# Altium project pay-optical.PrjPCB (part 1 of 2)
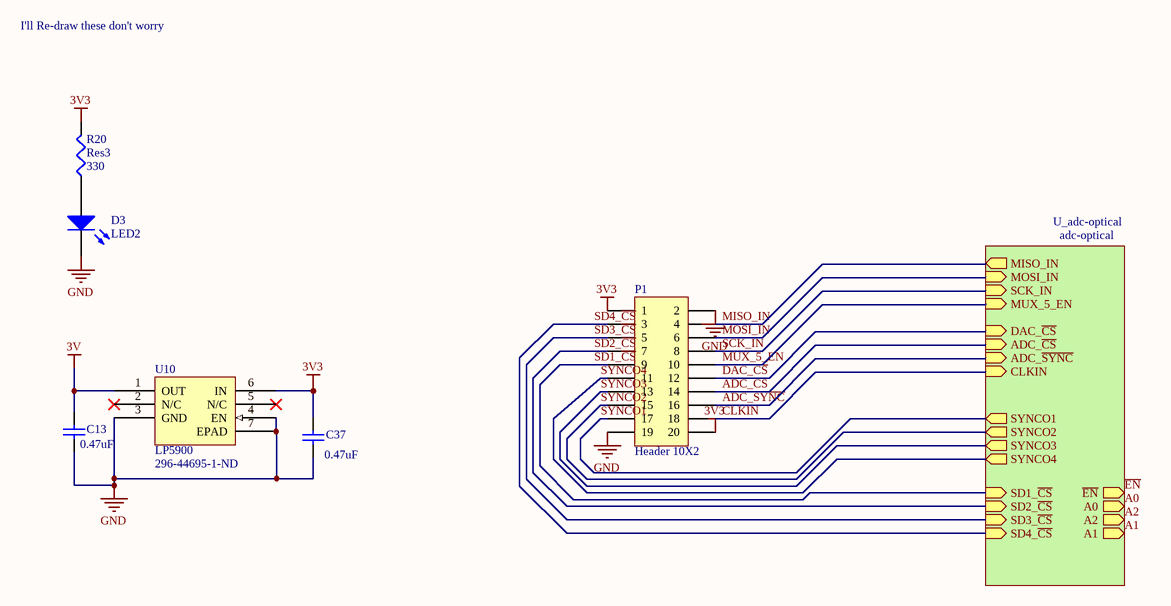
[diagram p0: pay-optical.SchDoc]
8 sheets, 629 parts. Net scope: hierarchical (ports join the sheet entries above them; power ports are global).
Board file: pay-optical.PcbDoc
Sheets:
  pay-optical.SchDoc
    U_adc-optical = adc-optical.SchDoc
      SD1 = filtering-optical.SchDoc
        AC1 = amplifier-chain.SchDoc
        AC2 = amplifier-chain.SchDoc
        AC3 = amplifier-chain.SchDoc
        AC4 = amplifier-chain.SchDoc
        AC5 = amplifier-chain.SchDoc
        AC6 = amplifier-chain.SchDoc
        AC7 = amplifier-chain.SchDoc
        AC8 = amplifier-chain.SchDoc
        MUX_LED = mux-optical.SchDoc
        MUX_S = mux-optical.SchDoc
      SD2 = filtering-optical.SchDoc
        AC1 = amplifier-chain.SchDoc
        AC2 = amplifier-chain.SchDoc
        AC3 = amplifier-chain.SchDoc
        AC4 = amplifier-chain.SchDoc
        AC5 = amplifier-chain.SchDoc
        AC6 = amplifier-chain.SchDoc
        AC7 = amplifier-chain.SchDoc
        AC8 = amplifier-chain.SchDoc
        MUX_LED = mux-optical.SchDoc
        MUX_S = mux-optical.SchDoc
      SD3 = filtering-optical.SchDoc
        AC1 = amplifier-chain.SchDoc
        AC2 = amplifier-chain.SchDoc
        AC3 = amplifier-chain.SchDoc
        AC4 = amplifier-chain.SchDoc
        AC5 = amplifier-chain.SchDoc
        AC6 = amplifier-chain.SchDoc
        AC7 = amplifier-chain.SchDoc
        AC8 = amplifier-chain.SchDoc
        MUX_LED = mux-optical.SchDoc
        MUX_S = mux-optical.SchDoc
      SD4 = filtering-optical.SchDoc
        AC1 = amplifier-chain.SchDoc
        AC2 = amplifier-chain.SchDoc
        AC3 = amplifier-chain.SchDoc
        AC4 = amplifier-chain.SchDoc
        AC5 = amplifier-chain.SchDoc
        AC6 = amplifier-chain.SchDoc
        AC7 = amplifier-chain.SchDoc
        AC8 = amplifier-chain.SchDoc
        MUX_LED = mux-optical.SchDoc
        MUX_S = mux-optical.SchDoc
      SD5_Special = filtering-optical-special.SchDoc
        AC1 = amplifier-chain.SchDoc
        AC2 = amplifier-chain.SchDoc
        MUX_LED = mux-optical.SchDoc
        MUX_S = mux-optical.SchDoc
        U_amplifier-special = amplifier-special.SchDoc
      U_dac-layout = dac-layout.SchDoc

## Sheet pay-optical.SchDoc: PAY-OPTICAL
size A4; DrawnBy: Dylan Vogel; Organization: UTAT SS; DocumentNumber: 1; Revision: 1; SheetNumber: 1; SheetTotal: 7

### Parts
C13  0.47uF  [1608[0603]]
C37  0.47uF  [1608[0603]]
D3  LED2  [0603-LED]
P1  Header 10X2  [CON20_2X10_DUA00]
R20  Res3  value 330  [0402]
U10  LP5900  Supplier Part Number 1: 296-44695-1-ND  [DFN220X250X80-7N]

### Sub-sheets
U_adc-optical = adc-optical: ADC_~{CS} (in), DAC_~{CS} (in), SD1_~{CS} (in), SD2_~{CS} (in), SD3_~{CS} (in), SD4_~{CS} (in), SYNCO1 (out), SYNCO2 (out), SYNCO3 (out), SYNCO4 (out), MISO_IN (out), MOSI_IN (in), SCK_IN (in), ~{EN} (out), A0 (out), A2 (out), A1 (out), ADC_~{SYNC} (in), MUX_5_EN (in), CLKIN (in)

### Nets
3V: C13.2 U10.1(OUT)
3V3: C37.2 P1.1 P1.20 R20.2 U10.6(IN)
GND: C13.1 C37.1 D3.2(K) P1.2 P1.19 U10.3(GND) U10.4(EN) U10.7(EPAD)
ADC_~{CS}: P1.14 ; sheet U_adc-optical/ADC_~{CS}
ADC_~{SYNC}: P1.16 ; sheet U_adc-optical/ADC_~{SYNC}
CLKIN: P1.18 ; sheet U_adc-optical/CLKIN
DAC_~{CS}: P1.12 ; sheet U_adc-optical/DAC_~{CS}
MISO_IN: P1.4 ; sheet U_adc-optical/MISO_IN  [project net MISO]
MOSI_IN: P1.6 ; sheet U_adc-optical/MOSI_IN  [project net MOSI]
MUX_5_EN: P1.10 ; sheet U_adc-optical/MUX_5_EN
SCK_IN: P1.8 ; sheet U_adc-optical/SCK_IN  [project net SCK]
SD1_~{CS}: P1.9 ; sheet U_adc-optical/SD1_~{CS}
SD2_~{CS}: P1.7 ; sheet U_adc-optical/SD2_~{CS}
SD3_~{CS}: P1.5 ; sheet U_adc-optical/SD3_~{CS}
SD4_~{CS}: P1.3 ; sheet U_adc-optical/SD4_~{CS}
SYNCO1: P1.17 ; sheet U_adc-optical/SYNCO1
SYNCO2: P1.15 ; sheet U_adc-optical/SYNCO2
SYNCO3: P1.13 ; sheet U_adc-optical/SYNCO3
SYNCO4: P1.11 ; sheet U_adc-optical/SYNCO4
NetD3_1: D3.1(A) R20.1

Not connected (* = marked no-connect by the designer): U10 2(N/C)* 5(N/C)*

### Notes on the sheet
- I'll Re-draw these don't worry

### Library data of the parts
C13 C37 = Cap Semi: Capacitor (Semiconductor SIM Model); Published: 8-Jun-2000; LatestRevisionDate: 29-May-2009; LatestRevisionNote: IPC-7351 Footprint Added.; PackageReference: C1206; Publisher: Altium Limited; PackageDescription: Chip Capacitor; Value: 0.47uF; Supplier: Digi-Key
D3 = LED2: Typical RED, GREEN, YELLOW, AMBER GaAs LED; Published: 8-Jun-2000; LatestRevisionDate: 17-Jul-2002; LatestRevisionNote: Re-released for DXP Platform.; PackageVersion: Feb-2002; PackageReference: 3.2X1.6X1.1; Publisher: Altium Limited; PackageDescription: SM LED; 2 Flat Leads
P1 = Header 10X2: Header, 10-Pin, Dual row; LatestRevisionDate: 17-Jul-2002; LatestRevisionNote: Re-released for DXP Platform.; Publisher: Altium Limited
R20 = Res3: Resistor; Published: 8-Jun-2000; LatestRevisionDate: 29-May-2009; LatestRevisionNote: IPC-7351 Footprint Added.; PackageReference: J1-0603; Publisher: Altium Limited; PackageDescription: Chip Resistor
U10 = LP5900: Low noise 3V low dropout regulator for analog and RF applications.; Supplier 1: Digi-Key

## Sheet adc-optical.SchDoc: ADC-OPTICAL
size A4; DrawnBy: Dylan Vogel; Organization: UTAT SS; DocumentNumber: 3; Revision: 1; SheetNumber: 3; SheetTotal: 7
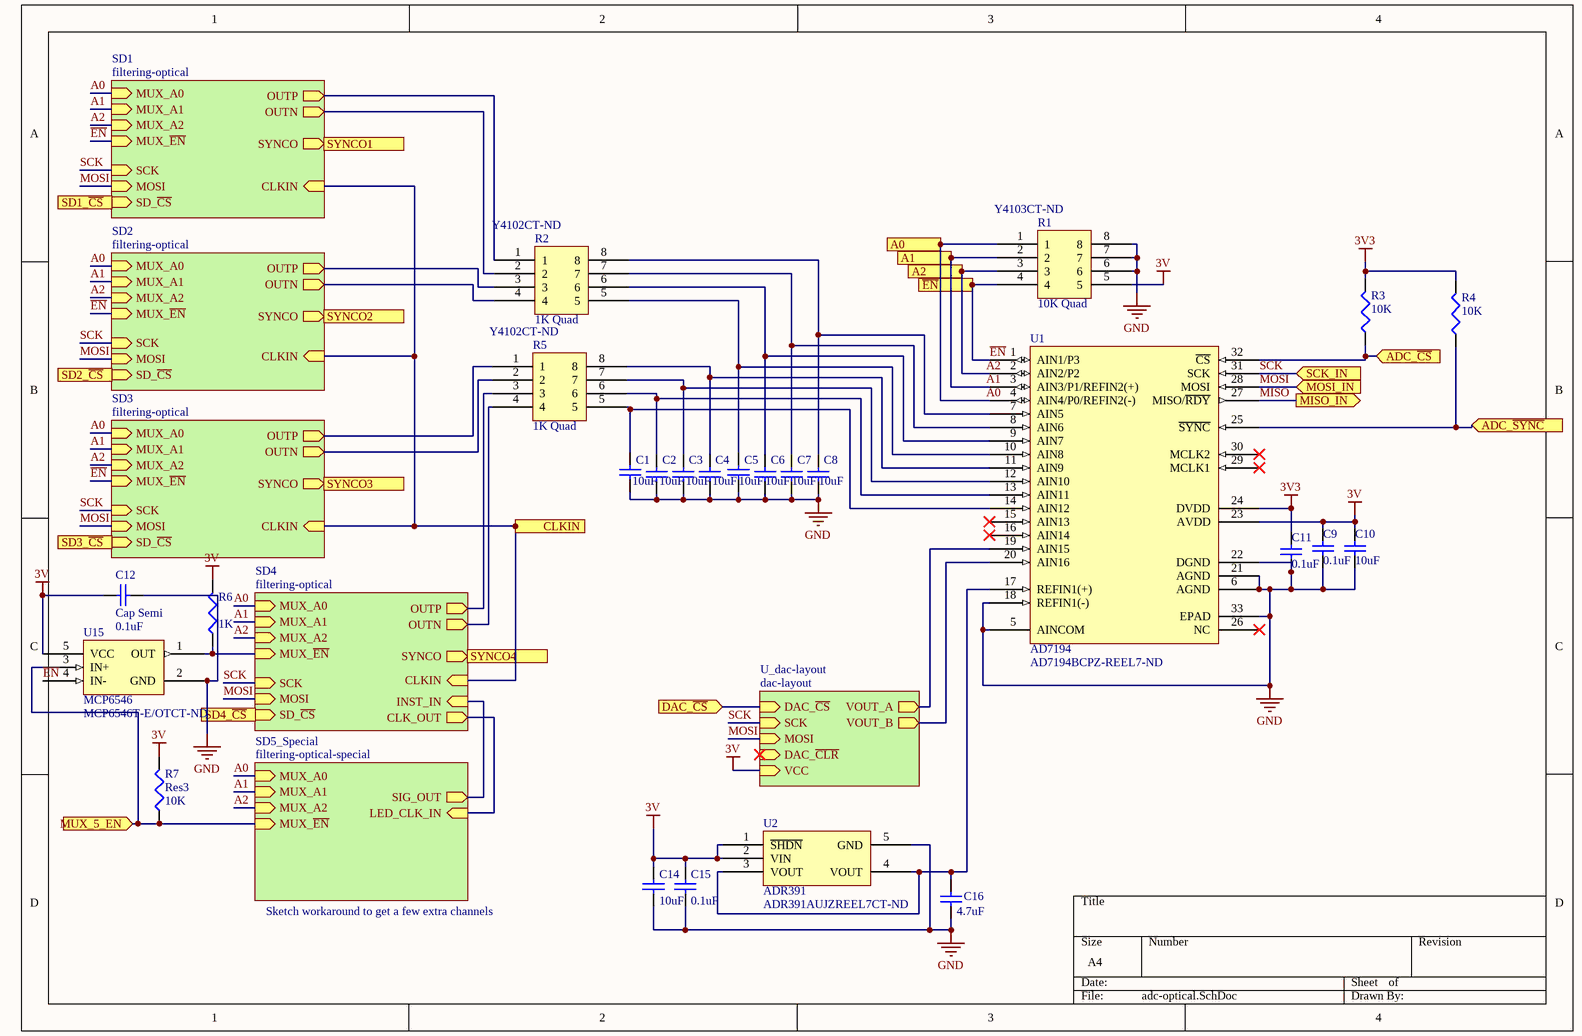
[diagram p1: adc-optical.SchDoc]

### Parts
C1  10uF  [1608[0603]]
C2  10uF  [1608[0603]]
C3  10uF  [1608[0603]]
C4  10uF  [1608[0603]]
C5  10uF  [1608[0603]]
C6  10uF  [1608[0603]]
C7  10uF  [1608[0603]]
C8  10uF  [1608[0603]]
C9  0.1uF  [0402]
C10  10uF  [1608[0603]]
C11  0.1uF  [0402]
C12  Cap Semi  value 0.1uF  [0402]
C14  10uF  [1608[0603]]
C15  0.1uF  [0402]
C16  4.7uF  [1608[0603]]
R1  10K Quad  Supplier Part Number: Y4103CT-ND  [ResQuad-320X150]
R2  1K Quad  Supplier Part Number: Y4102CT-ND  [ResQuad-320X150]
R3  10K  [0402]
R4  10K  [0402]
R5  1K Quad  Supplier Part Number: Y4102CT-ND  [ResQuad-320X150]
R6  value 1K  [0402]  (hidden comment: Res3)
R7  Res3  value 10K  [0402]
U1  AD7194  Supplier Part Number 1: AD7194BCPZ-REEL7-ND  [QFN50P500X500X100-32N]
U2  ADR391  Supplier Part Number 1: ADR391AUJZREEL7CT-ND  [SOT-23-5_95P290X160-5N]
U15  MCP6546  Supplier Part Number 1: MCP6546T-E/OTCT-ND  [SOT-23-5_95P290X160-5N]

### Sub-sheets
SD1 = filtering-optical: MUX_A0 (in), MUX_A1 (in), MUX_A2 (in), MUX_~{EN} (in), SCK (in), MOSI (in), SD_~{CS} (in), OUTP (out), OUTN (out), SYNCO (out), CLKIN (in)
SD2 = filtering-optical: MUX_A0 (in), MUX_A1 (in), MUX_A2 (in), MUX_~{EN} (in), SCK (in), MOSI (in), SD_~{CS} (in), OUTP (out), OUTN (out), SYNCO (out), CLKIN (in)
SD3 = filtering-optical: MUX_A0 (in), MUX_A1 (in), MUX_A2 (in), MUX_~{EN} (in), SCK (in), MOSI (in), SD_~{CS} (in), OUTP (out), OUTN (out), SYNCO (out), CLKIN (in)
SD4 = filtering-optical: MUX_A0 (in), MUX_A1 (in), MUX_A2 (in), MUX_~{EN} (in), SCK (in), MOSI (in), SD_~{CS} (in), OUTP (out), OUTN (out), SYNCO (out), CLKIN (in), CLK_OUT (out), INST_IN (in)
SD5_Special = filtering-optical-special: MUX_A0 (in), MUX_A1 (in), MUX_A2 (in), MUX_~{EN} (in), SIG_OUT (out), LED_CLK_IN (in)
U_dac-layout = dac-layout: VOUT_A (out), VOUT_B (out), DAC_~{CS} (in), SCK (in), MOSI (in), DAC_~{CLR} (in), VCC (in)

### Ports
A0 (out), A1 (out), A2 (out), ADC_~{CS} (in), ADC_~{SYNC} (in), CLKIN (in), DAC_~{CS} (in), MISO_IN (out), MOSI_IN (in), MUX_5_EN (in), SCK_IN (in), SD1_~{CS} (in), SD2_~{CS} (in), SD3_~{CS} (in), SD4_~{CS} (in), SYNCO1 (out), SYNCO2 (out), SYNCO3 (out), SYNCO4 (out), ~{EN} (out)

### Nets
3V: C9.2 C10.2 C12.2 C14.2 C15.2 R1.5 R6.2 R7.2 U1.23(AVDD) U2.1(~{SHDN}) U2.2(VIN) U15.5(VCC) ; sheet U_dac-layout/VCC
3V3: C11.2 R3.2 R4.2 U1.24(DVDD)
GND: C1.1 C2.1 C3.1 C4.1 C5.1 C6.1 C7.1 C8.1 C9.1 C10.1 C11.1 C12.1 C14.1 C15.1 C16.1 R1.6 R1.7 R1.8 U1.5(AINCOM) U1.6(AGND) U1.18(REFIN1(-)) U1.21(AGND) U1.22(DGND) U1.33(EPAD) U2.5(GND) U15.2(GND)
A0: R1.1 U1.4(AIN4/P0/REFIN2(-)) ; port A0, sheet SD1/MUX_A0, sheet SD2/MUX_A0, sheet SD3/MUX_A0, sheet SD4/MUX_A0, sheet SD5_Special/MUX_A0
A1: R1.2 U1.3(AIN3/P1/REFIN2(+)) ; port A1, sheet SD1/MUX_A1, sheet SD2/MUX_A1, sheet SD3/MUX_A1, sheet SD4/MUX_A1, sheet SD5_Special/MUX_A1
A2: R1.3 U1.2(AIN2/P2) ; port A2, sheet SD1/MUX_A2, sheet SD2/MUX_A2, sheet SD3/MUX_A2, sheet SD4/MUX_A2, sheet SD5_Special/MUX_A2
ADC_~{CS}: R3.1 U1.32(~{CS}) ; port ADC_~{CS}
ADC_~{SYNC}: R4.1 U1.25(~{SYNC}) ; port ADC_~{SYNC}
CLKIN: port CLKIN, sheet SD1/CLKIN, sheet SD2/CLKIN, sheet SD3/CLKIN, sheet SD4/CLKIN
DAC_~{CS}: port DAC_~{CS}, sheet U_dac-layout/DAC_~{CS}
~{EN}: R1.4 U1.1(AIN1/P3) U15.4(IN-) ; port ~{EN}, sheet SD1/MUX_~{EN}, sheet SD2/MUX_~{EN}, sheet SD3/MUX_~{EN}
MISO: U1.27(MISO/~{RDY}) ; port MISO_IN
MOSI: U1.28(MOSI) ; port MOSI_IN, sheet SD1/MOSI, sheet SD2/MOSI, sheet SD3/MOSI, sheet SD4/MOSI, sheet U_dac-layout/MOSI
MUX_5_EN: R7.1 U15.3(IN+) ; port MUX_5_EN, sheet SD5_Special/MUX_~{EN}
MUX_~{EN}: R6.1 U15.1(OUT) ; sheet SD4/MUX_~{EN}
SCK: U1.31(SCK) ; port SCK_IN, sheet SD1/SCK, sheet SD2/SCK, sheet SD3/SCK, sheet SD4/SCK, sheet U_dac-layout/SCK
SD1_~{CS}: port SD1_~{CS}, sheet SD1/SD_~{CS}
SD2_~{CS}: port SD2_~{CS}, sheet SD2/SD_~{CS}
SD3_~{CS}: port SD3_~{CS}, sheet SD3/SD_~{CS}
SD4_~{CS}: port SD4_~{CS}, sheet SD4/SD_~{CS}
SYNCO1: port SYNCO1, sheet SD1/SYNCO
SYNCO2: port SYNCO2, sheet SD2/SYNCO
SYNCO3: port SYNCO3, sheet SD3/SYNCO
SYNCO4: port SYNCO4, sheet SD4/SYNCO
NetC1_2: C1.2 R5.5 U1.14(AIN12)
NetC2_2: C2.2 R5.6 U1.13(AIN11)
NetC3_2: C3.2 R5.7 U1.12(AIN10)
NetC4_2: C4.2 R5.8 U1.11(AIN9)
NetC5_2: C5.2 R2.5 U1.10(AIN8)
NetC6_2: C6.2 R2.6 U1.9(AIN7)
NetC7_2: C7.2 R2.7 U1.8(AIN6)
NetC8_2: C8.2 R2.8 U1.7(AIN5)
NetC16_2: C16.2 U1.17(REFIN1(+)) U2.3(VOUT) U2.4(VOUT)
NetC27_SD4_2: sheet SD4/INST_IN, sheet SD5_Special/SIG_OUT
NetR2_1: R2.1 ; sheet SD1/OUTP
NetR2_2: R2.2 ; sheet SD1/OUTN
NetR2_3: R2.3 ; sheet SD2/OUTP
NetR2_4: R2.4 ; sheet SD2/OUTN
NetR5_1: R5.1 ; sheet SD3/OUTP
NetR5_2: R5.2 ; sheet SD3/OUTN
NetR5_3: R5.3 ; sheet SD4/OUTP
NetR5_4: R5.4 ; sheet SD4/OUTN
NetU1_19: U1.19(AIN15) ; sheet U_dac-layout/VOUT_A
NetU1_20: U1.20(AIN16) ; sheet U_dac-layout/VOUT_B
NetU9_SD4_1: sheet SD4/CLK_OUT, sheet SD5_Special/LED_CLK_IN

Not connected (* = marked no-connect by the designer): U1 15(AIN13)* 16(AIN14)* 26(NC)* 29(MCLK1)* 30(MCLK2)*

### Notes on the sheet
- Sketch workaround to get a few extra channels

### Library data of the parts
C1-C12 C14-C16 = Cap Semi: Capacitor (Semiconductor SIM Model); Published: 8-Jun-2000; LatestRevisionDate: 29-May-2009; LatestRevisionNote: IPC-7351 Footprint Added.; PackageReference: C1206; Publisher: Altium Limited; PackageDescription: Chip Capacitor
  C1-C8 C10 C14: Value: 10uF; Supplier: Digi-Key
  C9 C11 C15: Value: 0.1uF; Supplier: Digi-Key
  C16: Value: 4.7uF; Supplier: Digi-Key
R1 R2 R5 = Res Quad Pack: Quad pack resistor; Supplier: Digi-Key
  R1: Value: 10K Quad
  R2 R5: Value: 1K Quad
R3 R4 R6 R7 = Res3: Resistor; Published: 8-Jun-2000; LatestRevisionDate: 29-May-2009; LatestRevisionNote: IPC-7351 Footprint Added.; PackageReference: J1-0603; Publisher: Altium Limited; PackageDescription: Chip Resistor
  R3 R4: Value: 10K; Supplier: Digi-Key
U1 = AD7194: 24-bit sigma-delta ADC; Supplier 1: Digi-Key; Supplier: Digi-Key
U2 = ADR391: 2.5V reference voltage.; Supplier 1: Digi-Key; Supplier: Digi-Key
U15 = MCP6546: Open-drain output sub-microamp comparator.; Supplier 1: Digi-Key

## Sheet filtering-optical.SchDoc: FILTERING-OPTICAL
size A4; DrawnBy: Dylan Vogel; Organization: UTAT SS; DocumentNumber: 5; Revision: 1; SheetNumber: 5; SheetTotal: 7
Used 4 times, as channels U_adc-optical/SD1, U_adc-optical/SD2, U_adc-optical/SD3, U_adc-optical/SD4. Parts and nets are listed once, with the designators drawn on the sheet.
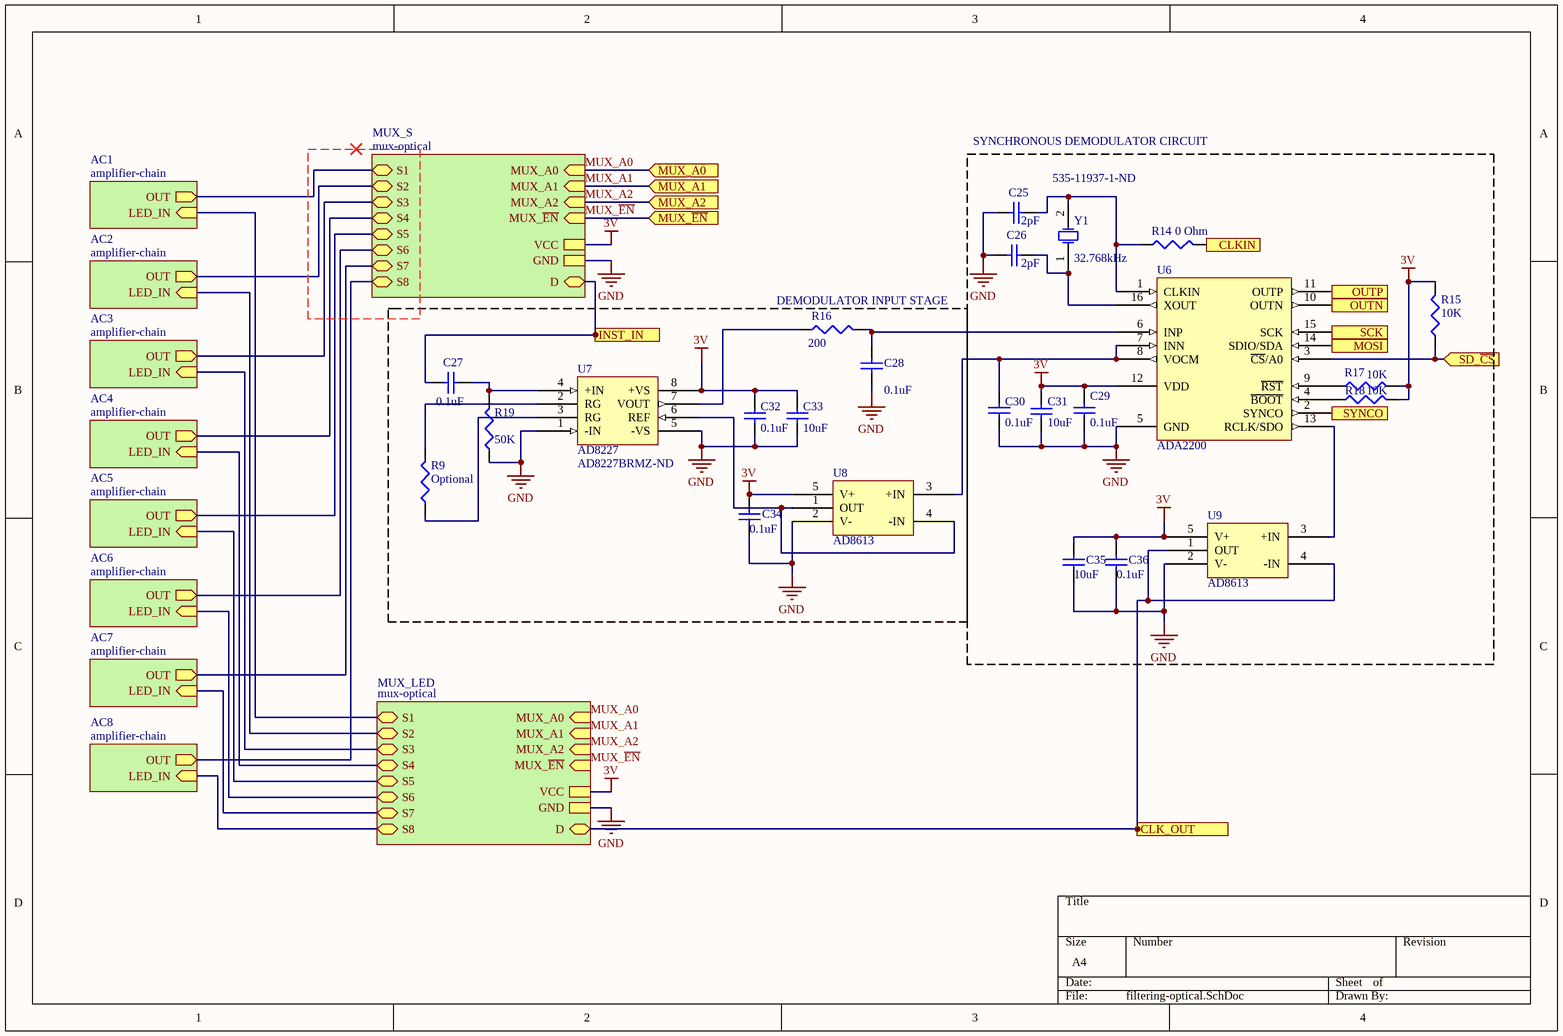
[diagram p2: filtering-optical.SchDoc]

### Parts
C25  2pF  [0402]
C26  2pF  [0402]
C27  0.1uF  [0402]
C28  0.1uF  [0402]
C29  0.1uF  [0402]
C30  0.1uF  [0402]
C31  10uF  [1608[0603]]
C32  0.1uF  [0402]
C33  10uF  [1608[0603]]
C34  0.1uF  [0402]
C35  10uF  [1608[0603]]
C36  0.1uF  [0402]
R9  Optional  [0402]
R14  0 Ohm  [0402]
R15  10K  [0402]
R16  200  [0402]
R17  10K  [0402]
R18  10K  [0402]
R19  50K  [0402]
U6  ADA2200  [SSOP16_N]
U7  AD8227  Supplier Part Number 1: AD8227BRMZ-ND  [SOP8-65P300X300-8N]
U8  AD8613  [SOP-65P200X125-5N]
U9  AD8613  [SOP-65P200X125-5N]
Y1  32.768kHz  Supplier Part Number: 535-11937-1-ND  [ABS07-120-32.768]

### Blocks framed on the sheet
SYNCHRONOUS DEMODULATOR CIRCUIT: C25 C26 C29-C31 C35 C36 R14 R15 R17 R18 U6 U9 Y1
DEMODULATOR INPUT STAGE: C27 C28 C32-C34 R9 R16 R19 U7 U8

### Sub-sheets
AC1 = amplifier-chain: OUT (out), LED_IN (in)
AC2 = amplifier-chain: OUT (out), LED_IN (in)
AC3 = amplifier-chain: OUT (out), LED_IN (in)
AC4 = amplifier-chain: OUT (out), LED_IN (in)
AC5 = amplifier-chain: OUT (out), LED_IN (in)
AC6 = amplifier-chain: OUT (out), LED_IN (in)
AC7 = amplifier-chain: OUT (out), LED_IN (in)
AC8 = amplifier-chain: OUT (out), LED_IN (in)
MUX_LED = mux-optical: MUX_A0 (in), MUX_A1 (in), MUX_A2 (in), MUX_~{EN} (in), VCC, GND, S1 (bidir), S2 (bidir), S3 (bidir), S4 (bidir), S5 (bidir), S6 (bidir), S7 (bidir), S8 (bidir), D (bidir)
MUX_S = mux-optical: MUX_A0 (in), MUX_A1 (in), MUX_A2 (in), MUX_~{EN} (in), VCC, GND, S1 (bidir), S2 (bidir), S3 (bidir), S4 (bidir), S5 (bidir), S6 (bidir), S7 (bidir), S8 (bidir), D (bidir)

### Ports
CLK_OUT (out), CLKIN (in), INST_IN (in), MOSI (in), MUX_A0 (in), MUX_A1 (in), MUX_A2 (in), MUX_~{EN} (in), OUTN (out), OUTP (out), SCK (in), SD_~{CS} (in), SYNCO (out)

### Nets
3V: C29.2 C31.1 C32.2 C33.2 C34.2 C35.2 C36.2 R15.2 R17.2 R18.2 U6.12(VDD) U7.8(+VS) U8.5(V+) U9.5(V+) ; sheet MUX_LED/VCC, sheet MUX_S/VCC
GND: C25.2 C26.2 C28.1 C29.1 C30.1 C31.2 C32.1 C33.1 C34.1 C35.1 C36.1 R19.1 U6.5(GND) U7.1(-IN) U7.5(-VS) U8.2(V-) U9.2(V-) ; sheet MUX_LED/GND, sheet MUX_S/GND
CLK_OUT: U9.1(OUT) U9.4(-IN) ; port CLK_OUT, sheet MUX_LED/D
CLKIN: R14.2 ; port CLKIN
INST_IN: C27.2 ; port INST_IN, sheet MUX_S/D
MOSI: U6.14(SDIO/SDA) ; port MOSI
MUX_A0: port MUX_A0, sheet MUX_LED/MUX_A0, sheet MUX_S/MUX_A0
MUX_A1: port MUX_A1, sheet MUX_LED/MUX_A1, sheet MUX_S/MUX_A1
MUX_A2: port MUX_A2, sheet MUX_LED/MUX_A2, sheet MUX_S/MUX_A2
MUX_~{EN}: port MUX_~{EN}, sheet MUX_LED/MUX_~{EN}, sheet MUX_S/MUX_~{EN}
OUTN: U6.10(OUTN) ; port OUTN
OUTP: U6.11(OUTP) ; port OUTP
SCK: U6.15(SCK) ; port SCK
SD_~{CS}: R15.1 U6.3(~{CS}/A0) ; port SD_~{CS}
SYNCO: U6.2(SYNCO) ; port SYNCO
NetC25_1: C25.1 R14.1 U6.1(CLKIN) Y1.2(OSC2)
NetC26_1: C26.1 U6.16(XOUT) Y1.1(OSC1)
NetC27_1: C27.1 R19.2 U7.4(+IN)
NetC28_2: C28.2 R16.2 U6.6(INP)
NetC30_2: C30.2 U6.7(INN) U6.8(VOCM) U8.3(+IN)
NetR9_1: R9.1 U7.3(RG)
NetR9_2: R9.2 U7.2(RG)
NetR16_1: R16.1 U7.7(VOUT)
NetR17_1: R17.1 U6.9(~{RST})
NetR18_1: R18.1 U6.4(~{BOOT})
NetU6_13: U6.13(RCLK/SDO) U9.3(+IN)
NetU7_6: U7.6(REF) U8.1(OUT) U8.4(-IN)
(unnamed): sheet AC1/OUT, sheet MUX_S/S1
(unnamed): sheet AC1/LED_IN, sheet MUX_LED/S1
(unnamed): sheet AC2/OUT, sheet MUX_S/S2
(unnamed): sheet AC2/LED_IN, sheet MUX_LED/S2
(unnamed): sheet AC3/OUT, sheet MUX_S/S3
(unnamed): sheet AC3/LED_IN, sheet MUX_LED/S3
(unnamed): sheet AC4/OUT, sheet MUX_S/S4
(unnamed): sheet AC4/LED_IN, sheet MUX_LED/S4
(unnamed): sheet AC5/OUT, sheet MUX_S/S5
(unnamed): sheet AC5/LED_IN, sheet MUX_LED/S5
(unnamed): sheet AC6/OUT, sheet MUX_S/S6
(unnamed): sheet AC6/LED_IN, sheet MUX_LED/S6
(unnamed): sheet AC7/OUT, sheet MUX_S/S7
(unnamed): sheet AC7/LED_IN, sheet MUX_LED/S7
(unnamed): sheet AC8/OUT, sheet MUX_S/S8
(unnamed): sheet AC8/LED_IN, sheet MUX_LED/S8

### Channels
U_adc-optical/SD1: designators end in _SD1; ports CLK_OUT=NetU9_SD1_1 CLKIN=CLKIN INST_IN=NetC27_SD1_2 MOSI=MOSI MUX_A0=A0 MUX_A1=A1 MUX_A2=A2 MUX_~{EN}=~{EN} OUTN=NetR2_2 OUTP=NetR2_1 SCK=SCK SD_~{CS}=SD1_~{CS} SYNCO=SYNCO1
U_adc-optical/SD2: designators end in _SD2; ports CLK_OUT=NetU9_SD2_1 CLKIN=CLKIN INST_IN=NetC27_SD2_2 MOSI=MOSI MUX_A0=A0 MUX_A1=A1 MUX_A2=A2 MUX_~{EN}=~{EN} OUTN=NetR2_4 OUTP=NetR2_3 SCK=SCK SD_~{CS}=SD2_~{CS} SYNCO=SYNCO2
U_adc-optical/SD3: designators end in _SD3; ports CLK_OUT=NetU9_SD3_1 CLKIN=CLKIN INST_IN=NetC27_SD3_2 MOSI=MOSI MUX_A0=A0 MUX_A1=A1 MUX_A2=A2 MUX_~{EN}=~{EN} OUTN=NetR5_2 OUTP=NetR5_1 SCK=SCK SD_~{CS}=SD3_~{CS} SYNCO=SYNCO3
U_adc-optical/SD4: designators end in _SD4; ports CLK_OUT=NetU9_SD4_1 CLKIN=CLKIN INST_IN=NetC27_SD4_2 MOSI=MOSI MUX_A0=A0 MUX_A1=A1 MUX_A2=A2 MUX_~{EN}=MUX_~{EN} OUTN=NetR5_4 OUTP=NetR5_3 SCK=SCK SD_~{CS}=SD4_~{CS} SYNCO=SYNCO4

### Notes on the sheet
- Cut-off frequency is 32 Hz, minimal effect on phase of 500 Hz signal. AC coupling for instrumentation amplifier input.
- (near U7) No resistor on RG sets 5x gain on amplifier.

### Library data of the parts
C25-C36 = Cap Semi: Capacitor (Semiconductor SIM Model); Published: 8-Jun-2000; LatestRevisionDate: 29-May-2009; LatestRevisionNote: IPC-7351 Footprint Added.; PackageReference: C1206; Publisher: Altium Limited; PackageDescription: Chip Capacitor; Supplier: Digi-Key
  C25 C26: Value: 2pF
  C27-C30 C32 C34 C36: Value: 0.1uF
  C31 C33 C35: Value: 10uF
R9 = Res3: Optional resistor to set gain on inst amp.; Published: 8-Jun-2000; LatestRevisionDate: 29-May-2009; LatestRevisionNote: IPC-7351 Footprint Added.; PackageReference: J1-0603; Publisher: Altium Limited; PackageDescription: Chip Resistor
R14-R19 = Res3: Resistor; Published: 8-Jun-2000; LatestRevisionDate: 29-May-2009; LatestRevisionNote: IPC-7351 Footprint Added.; PackageReference: J1-0603; Publisher: Altium Limited; PackageDescription: Chip Resistor; Supplier: Digi-Key
  R14: Value: 0 Ohm
  R15 R17 R18: Value: 10K
  R16: Value: 200
  R19: Value: 50K
U6 = ADA2200: Synchronous demodulator and configurable analog filter.; Supplier: Digi-Key
U7 = AD8227: Rail-to-rail instrumentation amplifier. Can operate on single supply.; Supplier 1: Digi-Key; Supplier: Digi-Key
U8 U9 = AD8613: Low power, low noise rail-to-rail op-amp.; Supplier: Digi-Key
Y1 = XTAL: Crystal Oscillator; Published: 8-Jun-2000; LatestRevisionDate: 17-Jul-2002; LatestRevisionNote: Re-released for DXP Platform.; PackageReference: R38; Publisher: Altium Limited; PackageDescription: Crystal, Thru-Hole; 2 Leads; Body 3.1 x 8.2 mm (Dia.xH); Supplier: Digi-Key

## Sheet amplifier-chain.SchDoc: AMPLIFIER-OPTICAL
size A4; DrawnBy: Dylan Vogel; Organization: UTAT SS; DocumentNumber: 7; Revision: 1; SheetNumber: 7; SheetTotal: 7
Used 34 times, as channels U_adc-optical/SD1/AC1, U_adc-optical/SD1/AC2, U_adc-optical/SD1/AC3, U_adc-optical/SD1/AC4, U_adc-optical/SD1/AC5, U_adc-optical/SD1/AC6, U_adc-optical/SD1/AC7, U_adc-optical/SD1/AC8, U_adc-optical/SD2/AC1, U_adc-optical/SD2/AC2, U_adc-optical/SD2/AC3, U_adc-optical/SD2/AC4, U_adc-optical/SD2/AC5, U_adc-optical/SD2/AC6, U_adc-optical/SD2/AC7, U_adc-optical/SD2/AC8, U_adc-optical/SD3/AC1, U_adc-optical/SD3/AC2, U_adc-optical/SD3/AC3, U_adc-optical/SD3/AC4, U_adc-optical/SD3/AC5, U_adc-optical/SD3/AC6, U_adc-optical/SD3/AC7, U_adc-optical/SD3/AC8, U_adc-optical/SD4/AC1, U_adc-optical/SD4/AC2, U_adc-optical/SD4/AC3, U_adc-optical/SD4/AC4, U_adc-optical/SD4/AC5, U_adc-optical/SD4/AC6, U_adc-optical/SD4/AC7, U_adc-optical/SD4/AC8, U_adc-optical/SD5_Special/AC1, U_adc-optical/SD5_Special/AC2. Parts and nets are listed once, with the designators drawn on the sheet.
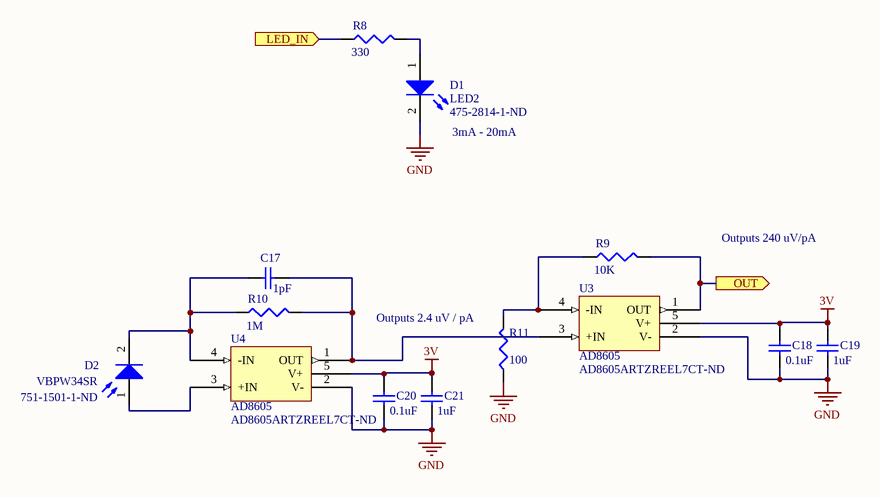
[diagram p3: amplifier-chain.SchDoc]

### Parts
C17  1pF  [1608[0603]]
C18  0.1uF  [1608[0603]]
C19  1uF  [1608[0603]]
C20  0.1uF  [1608[0603]]
C21  1uF  [1608[0603]]
D1  LED2  Supplier Part Number: 475-2814-1-ND  [LB P4SG]
D2  VBPW34SR  Supplier Part Number: 751-1501-1-ND  [VBPW34SR]
R8  330  [J1-0603]
R9  10K  [J1-0603]
R10  1M  [J1-0603]
R11  100  [J1-0603]
U3  AD8605  Supplier Part Number 1: AD8605ARTZREEL7CT-ND  [SOT23-6_N]
U4  AD8605  Supplier Part Number 1: AD8605ARTZREEL7CT-ND  [SOT23-6_N]

### Ports
LED_IN (in), OUT (out)

### Nets
3V: C18.2 C19.2 C20.2 C21.2 U3.5(V+) U4.5(V+)
GND: C18.1 C19.1 C20.1 C21.1 D1.2(K) R11.1 U3.2(V-) U4.2(V-)
LED_IN: R8.1 ; port LED_IN
OUT: R9.2 U3.1(OUT) ; port OUT
NetC17_1: C17.1 D2.2(K) R10.1 U4.4(-IN)
NetC17_2: C17.2 R10.2 U3.3(+IN) U4.1(OUT)
NetD1_1: D1.1(A) R8.2
NetD2_1: D2.1(A) U4.3(+IN)
NetR9_1: R9.1 R11.2 U3.4(-IN)

### Channels
U_adc-optical/SD1/AC1: designators C17=C17_AC11 C18=C18_U_adc-optical_SD1_AC1 C19=C19_U_adc-optical_SD1_AC1 C20=C20_AC11 C21=C21_AC11 D1=D1_AC11 D2=D2_AC11 R8=R8_AC11 R9=R9_U_adc-optical_SD1_AC1 R10=R10_AC11 R11=R11_U_adc-optical_SD1_AC1 U3=U3_U_adc-optical_SD1_AC1 U4=U4_AC11; ports LED_IN=NetR8_AC11_1 OUT=NetR9_U_adc-optical_SD1_AC1_2
U_adc-optical/SD1/AC2: designators C17=C17_AC21 C18=C18_U_adc-optical_SD1_AC2 C19=C19_U_adc-optical_SD1_AC2 C20=C20_AC21 C21=C21_AC21 D1=D1_AC21 D2=D2_AC21 R8=R8_AC21 R9=R9_U_adc-optical_SD1_AC2 R10=R10_AC21 R11=R11_U_adc-optical_SD1_AC2 U3=U3_U_adc-optical_SD1_AC2 U4=U4_AC21; ports LED_IN=NetR8_AC21_1 OUT=NetR9_U_adc-optical_SD1_AC2_2
U_adc-optical/SD1/AC3: designators C17=C17_AC31 C18=C18_U_adc-optical_SD1_AC3 C19=C19_U_adc-optical_SD1_AC3 C20=C20_AC31 C21=C21_AC31 D1=D1_AC31 D2=D2_AC31 R8=R8_AC31 R9=R9_U_adc-optical_SD1_AC3 R10=R10_AC31 R11=R11_U_adc-optical_SD1_AC3 U3=U3_U_adc-optical_SD1_AC3 U4=U4_AC31; ports LED_IN=NetR8_AC31_1 OUT=NetR9_U_adc-optical_SD1_AC3_2
U_adc-optical/SD1/AC4: designators C17=C17_AC41 C18=C18_U_adc-optical_SD1_AC4 C19=C19_U_adc-optical_SD1_AC4 C20=C20_AC41 C21=C21_AC41 D1=D1_AC41 D2=D2_AC41 R8=R8_AC41 R9=R9_U_adc-optical_SD1_AC4 R10=R10_AC41 R11=R11_U_adc-optical_SD1_AC4 U3=U3_U_adc-optical_SD1_AC4 U4=U4_AC41; ports LED_IN=NetR8_AC41_1 OUT=NetR9_U_adc-optical_SD1_AC4_2
U_adc-optical/SD1/AC5: designators C17=C17_AC51 C18=C18_U_adc-optical_SD1_AC5 C19=C19_U_adc-optical_SD1_AC5 C20=C20_AC51 C21=C21_AC51 D1=D1_AC51 D2=D2_AC51 R8=R8_AC51 R9=R9_U_adc-optical_SD1_AC5 R10=R10_AC51 R11=R11_U_adc-optical_SD1_AC5 U3=U3_U_adc-optical_SD1_AC5 U4=U4_AC51; ports LED_IN=NetR8_AC51_1 OUT=NetR9_U_adc-optical_SD1_AC5_2
U_adc-optical/SD1/AC6: designators C17=C17_AC61 C18=C18_U_adc-optical_SD1_AC6 C19=C19_U_adc-optical_SD1_AC6 C20=C20_AC61 C21=C21_AC61 D1=D1_AC61 D2=D2_AC61 R8=R8_AC61 R9=R9_U_adc-optical_SD1_AC6 R10=R10_AC61 R11=R11_U_adc-optical_SD1_AC6 U3=U3_U_adc-optical_SD1_AC6 U4=U4_AC61; ports LED_IN=NetR8_AC61_1 OUT=NetR9_U_adc-optical_SD1_AC6_2
U_adc-optical/SD1/AC7: designators C17=C17_AC71 C18=C18_U_adc-optical_SD1_AC7 C19=C19_U_adc-optical_SD1_AC7 C20=C20_AC71 C21=C21_AC71 D1=D1_AC71 D2=D2_AC71 R8=R8_AC71 R9=R9_U_adc-optical_SD1_AC7 R10=R10_AC71 R11=R11_U_adc-optical_SD1_AC7 U3=U3_U_adc-optical_SD1_AC7 U4=U4_AC71; ports LED_IN=NetR8_AC71_1 OUT=NetR9_U_adc-optical_SD1_AC7_2
U_adc-optical/SD1/AC8: designators C17=C17_AC81 C18=C18_U_adc-optical_SD1_AC8 C19=C19_U_adc-optical_SD1_AC8 C20=C20_AC81 C21=C21_AC81 D1=D1_AC81 D2=D2_AC81 R8=R8_AC81 R9=R9_U_adc-optical_SD1_AC8 R10=R10_AC81 R11=R11_U_adc-optical_SD1_AC8 U3=U3_U_adc-optical_SD1_AC8 U4=U4_AC81; ports LED_IN=NetR8_AC81_1 OUT=NetR9_U_adc-optical_SD1_AC8_2
U_adc-optical/SD2/AC1: designators C17=C17_AC12 C18=C18_U_adc-optical_SD2_AC1 C19=C19_U_adc-optical_SD2_AC1 C20=C20_AC12 C21=C21_AC12 D1=D1_AC12 D2=D2_AC12 R8=R8_AC12 R9=R9_U_adc-optical_SD2_AC1 R10=R10_AC12 R11=R11_U_adc-optical_SD2_AC1 U3=U3_U_adc-optical_SD2_AC1 U4=U4_AC12; ports LED_IN=NetR8_AC12_1 OUT=NetR9_U_adc-optical_SD2_AC1_2
U_adc-optical/SD2/AC2: designators C17=C17_AC22 C18=C18_U_adc-optical_SD2_AC2 C19=C19_U_adc-optical_SD2_AC2 C20=C20_AC22 C21=C21_AC22 D1=D1_AC22 D2=D2_AC22 R8=R8_AC22 R9=R9_U_adc-optical_SD2_AC2 R10=R10_AC22 R11=R11_U_adc-optical_SD2_AC2 U3=U3_U_adc-optical_SD2_AC2 U4=U4_AC22; ports LED_IN=NetR8_AC22_1 OUT=NetR9_U_adc-optical_SD2_AC2_2
U_adc-optical/SD2/AC3: designators C17=C17_AC32 C18=C18_U_adc-optical_SD2_AC3 C19=C19_U_adc-optical_SD2_AC3 C20=C20_AC32 C21=C21_AC32 D1=D1_AC32 D2=D2_AC32 R8=R8_AC32 R9=R9_U_adc-optical_SD2_AC3 R10=R10_AC32 R11=R11_U_adc-optical_SD2_AC3 U3=U3_U_adc-optical_SD2_AC3 U4=U4_AC32; ports LED_IN=NetR8_AC32_1 OUT=NetR9_U_adc-optical_SD2_AC3_2
U_adc-optical/SD2/AC4: designators C17=C17_AC42 C18=C18_U_adc-optical_SD2_AC4 C19=C19_U_adc-optical_SD2_AC4 C20=C20_AC42 C21=C21_AC42 D1=D1_AC42 D2=D2_AC42 R8=R8_AC42 R9=R9_U_adc-optical_SD2_AC4 R10=R10_AC42 R11=R11_U_adc-optical_SD2_AC4 U3=U3_U_adc-optical_SD2_AC4 U4=U4_AC42; ports LED_IN=NetR8_AC42_1 OUT=NetR9_U_adc-optical_SD2_AC4_2
U_adc-optical/SD2/AC5: designators C17=C17_AC52 C18=C18_U_adc-optical_SD2_AC5 C19=C19_U_adc-optical_SD2_AC5 C20=C20_AC52 C21=C21_AC52 D1=D1_AC52 D2=D2_AC52 R8=R8_AC52 R9=R9_U_adc-optical_SD2_AC5 R10=R10_AC52 R11=R11_U_adc-optical_SD2_AC5 U3=U3_U_adc-optical_SD2_AC5 U4=U4_AC52; ports LED_IN=NetR8_AC52_1 OUT=NetR9_U_adc-optical_SD2_AC5_2
U_adc-optical/SD2/AC6: designators C17=C17_AC62 C18=C18_U_adc-optical_SD2_AC6 C19=C19_U_adc-optical_SD2_AC6 C20=C20_AC62 C21=C21_AC62 D1=D1_AC62 D2=D2_AC62 R8=R8_AC62 R9=R9_U_adc-optical_SD2_AC6 R10=R10_AC62 R11=R11_U_adc-optical_SD2_AC6 U3=U3_U_adc-optical_SD2_AC6 U4=U4_AC62; ports LED_IN=NetR8_AC62_1 OUT=NetR9_U_adc-optical_SD2_AC6_2
U_adc-optical/SD2/AC7: designators C17=C17_AC72 C18=C18_U_adc-optical_SD2_AC7 C19=C19_U_adc-optical_SD2_AC7 C20=C20_AC72 C21=C21_AC72 D1=D1_AC72 D2=D2_AC72 R8=R8_AC72 R9=R9_U_adc-optical_SD2_AC7 R10=R10_AC72 R11=R11_U_adc-optical_SD2_AC7 U3=U3_U_adc-optical_SD2_AC7 U4=U4_AC72; ports LED_IN=NetR8_AC72_1 OUT=NetR9_U_adc-optical_SD2_AC7_2
U_adc-optical/SD2/AC8: designators C17=C17_AC82 C18=C18_U_adc-optical_SD2_AC8 C19=C19_U_adc-optical_SD2_AC8 C20=C20_AC82 C21=C21_AC82 D1=D1_AC82 D2=D2_AC82 R8=R8_AC82 R9=R9_U_adc-optical_SD2_AC8 R10=R10_AC82 R11=R11_U_adc-optical_SD2_AC8 U3=U3_U_adc-optical_SD2_AC8 U4=U4_AC82; ports LED_IN=NetR8_AC82_1 OUT=NetR9_U_adc-optical_SD2_AC8_2
U_adc-optical/SD3/AC1: designators C17=C17_AC13 C18=C18_U_adc-optical_SD3_AC1 C19=C19_U_adc-optical_SD3_AC1 C20=C20_AC13 C21=C21_AC13 D1=D1_AC13 D2=D2_AC13 R8=R8_AC13 R9=R9_U_adc-optical_SD3_AC1 R10=R10_AC13 R11=R11_U_adc-optical_SD3_AC1 U3=U3_U_adc-optical_SD3_AC1 U4=U4_AC13; ports LED_IN=NetR8_AC13_1 OUT=NetR9_U_adc-optical_SD3_AC1_2
U_adc-optical/SD3/AC2: designators C17=C17_AC23 C18=C18_U_adc-optical_SD3_AC2 C19=C19_U_adc-optical_SD3_AC2 C20=C20_AC23 C21=C21_AC23 D1=D1_AC23 D2=D2_AC23 R8=R8_AC23 R9=R9_U_adc-optical_SD3_AC2 R10=R10_AC23 R11=R11_U_adc-optical_SD3_AC2 U3=U3_U_adc-optical_SD3_AC2 U4=U4_AC23; ports LED_IN=NetR8_AC23_1 OUT=NetR9_U_adc-optical_SD3_AC2_2
U_adc-optical/SD3/AC3: designators C17=C17_AC33 C18=C18_U_adc-optical_SD3_AC3 C19=C19_U_adc-optical_SD3_AC3 C20=C20_AC33 C21=C21_AC33 D1=D1_AC33 D2=D2_AC33 R8=R8_AC33 R9=R9_U_adc-optical_SD3_AC3 R10=R10_AC33 R11=R11_U_adc-optical_SD3_AC3 U3=U3_U_adc-optical_SD3_AC3 U4=U4_AC33; ports LED_IN=NetR8_AC33_1 OUT=NetR9_U_adc-optical_SD3_AC3_2
U_adc-optical/SD3/AC4: designators C17=C17_AC43 C18=C18_U_adc-optical_SD3_AC4 C19=C19_U_adc-optical_SD3_AC4 C20=C20_AC43 C21=C21_AC43 D1=D1_AC43 D2=D2_AC43 R8=R8_AC43 R9=R9_U_adc-optical_SD3_AC4 R10=R10_AC43 R11=R11_U_adc-optical_SD3_AC4 U3=U3_U_adc-optical_SD3_AC4 U4=U4_AC43; ports LED_IN=NetR8_AC43_1 OUT=NetR9_U_adc-optical_SD3_AC4_2
U_adc-optical/SD3/AC5: designators C17=C17_AC53 C18=C18_U_adc-optical_SD3_AC5 C19=C19_U_adc-optical_SD3_AC5 C20=C20_AC53 C21=C21_AC53 D1=D1_AC53 D2=D2_AC53 R8=R8_AC53 R9=R9_U_adc-optical_SD3_AC5 R10=R10_AC53 R11=R11_U_adc-optical_SD3_AC5 U3=U3_U_adc-optical_SD3_AC5 U4=U4_AC53; ports LED_IN=NetR8_AC53_1 OUT=NetR9_U_adc-optical_SD3_AC5_2
U_adc-optical/SD3/AC6: designators C17=C17_AC63 C18=C18_U_adc-optical_SD3_AC6 C19=C19_U_adc-optical_SD3_AC6 C20=C20_AC63 C21=C21_AC63 D1=D1_AC63 D2=D2_AC63 R8=R8_AC63 R9=R9_U_adc-optical_SD3_AC6 R10=R10_AC63 R11=R11_U_adc-optical_SD3_AC6 U3=U3_U_adc-optical_SD3_AC6 U4=U4_AC63; ports LED_IN=NetR8_AC63_1 OUT=NetR9_U_adc-optical_SD3_AC6_2
U_adc-optical/SD3/AC7: designators C17=C17_AC73 C18=C18_U_adc-optical_SD3_AC7 C19=C19_U_adc-optical_SD3_AC7 C20=C20_AC73 C21=C21_AC73 D1=D1_AC73 D2=D2_AC73 R8=R8_AC73 R9=R9_U_adc-optical_SD3_AC7 R10=R10_AC73 R11=R11_U_adc-optical_SD3_AC7 U3=U3_U_adc-optical_SD3_AC7 U4=U4_AC73; ports LED_IN=NetR8_AC73_1 OUT=NetR9_U_adc-optical_SD3_AC7_2
U_adc-optical/SD3/AC8: designators C17=C17_AC83 C18=C18_U_adc-optical_SD3_AC8 C19=C19_U_adc-optical_SD3_AC8 C20=C20_AC83 C21=C21_AC83 D1=D1_AC83 D2=D2_AC83 R8=R8_AC83 R9=R9_U_adc-optical_SD3_AC8 R10=R10_AC83 R11=R11_U_adc-optical_SD3_AC8 U3=U3_U_adc-optical_SD3_AC8 U4=U4_AC83; ports LED_IN=NetR8_AC83_1 OUT=NetR9_U_adc-optical_SD3_AC8_2
U_adc-optical/SD4/AC1: designators C17=C17_AC14 C18=C18_U_adc-optical_SD4_AC1 C19=C19_U_adc-optical_SD4_AC1 C20=C20_AC14 C21=C21_AC14 D1=D1_AC14 D2=D2_AC14 R8=R8_AC14 R9=R9_U_adc-optical_SD4_AC1 R10=R10_AC14 R11=R11_U_adc-optical_SD4_AC1 U3=U3_U_adc-optical_SD4_AC1 U4=U4_AC14; ports LED_IN=NetR8_AC14_1 OUT=NetR9_U_adc-optical_SD4_AC1_2
U_adc-optical/SD4/AC2: designators C17=C17_AC24 C18=C18_U_adc-optical_SD4_AC2 C19=C19_U_adc-optical_SD4_AC2 C20=C20_AC24 C21=C21_AC24 D1=D1_AC24 D2=D2_AC24 R8=R8_AC24 R9=R9_U_adc-optical_SD4_AC2 R10=R10_AC24 R11=R11_U_adc-optical_SD4_AC2 U3=U3_U_adc-optical_SD4_AC2 U4=U4_AC24; ports LED_IN=NetR8_AC24_1 OUT=NetR9_U_adc-optical_SD4_AC2_2
U_adc-optical/SD4/AC3: designators C17=C17_AC34 C18=C18_U_adc-optical_SD4_AC3 C19=C19_U_adc-optical_SD4_AC3 C20=C20_AC34 C21=C21_AC34 D1=D1_AC34 D2=D2_AC34 R8=R8_AC34 R9=R9_U_adc-optical_SD4_AC3 R10=R10_AC34 R11=R11_U_adc-optical_SD4_AC3 U3=U3_U_adc-optical_SD4_AC3 U4=U4_AC34; ports LED_IN=NetR8_AC34_1 OUT=NetR9_U_adc-optical_SD4_AC3_2
U_adc-optical/SD4/AC4: designators C17=C17_AC44 C18=C18_U_adc-optical_SD4_AC4 C19=C19_U_adc-optical_SD4_AC4 C20=C20_AC44 C21=C21_AC44 D1=D1_AC44 D2=D2_AC44 R8=R8_AC44 R9=R9_U_adc-optical_SD4_AC4 R10=R10_AC44 R11=R11_U_adc-optical_SD4_AC4 U3=U3_U_adc-optical_SD4_AC4 U4=U4_AC44; ports LED_IN=NetR8_AC44_1 OUT=NetR9_U_adc-optical_SD4_AC4_2
U_adc-optical/SD4/AC5: designators C17=C17_AC54 C18=C18_U_adc-optical_SD4_AC5 C19=C19_U_adc-optical_SD4_AC5 C20=C20_AC54 C21=C21_AC54 D1=D1_AC54 D2=D2_AC54 R8=R8_AC54 R9=R9_U_adc-optical_SD4_AC5 R10=R10_AC54 R11=R11_U_adc-optical_SD4_AC5 U3=U3_U_adc-optical_SD4_AC5 U4=U4_AC54; ports LED_IN=NetR8_AC54_1 OUT=NetR9_U_adc-optical_SD4_AC5_2
U_adc-optical/SD4/AC6: designators C17=C17_AC64 C18=C18_U_adc-optical_SD4_AC6 C19=C19_U_adc-optical_SD4_AC6 C20=C20_AC64 C21=C21_AC64 D1=D1_AC64 D2=D2_AC64 R8=R8_AC64 R9=R9_U_adc-optical_SD4_AC6 R10=R10_AC64 R11=R11_U_adc-optical_SD4_AC6 U3=U3_U_adc-optical_SD4_AC6 U4=U4_AC64; ports LED_IN=NetR8_AC64_1 OUT=NetR9_U_adc-optical_SD4_AC6_2
U_adc-optical/SD4/AC7: designators C17=C17_AC74 C18=C18_U_adc-optical_SD4_AC7 C19=C19_U_adc-optical_SD4_AC7 C20=C20_AC74 C21=C21_AC74 D1=D1_AC74 D2=D2_AC74 R8=R8_AC74 R9=R9_U_adc-optical_SD4_AC7 R10=R10_AC74 R11=R11_U_adc-optical_SD4_AC7 U3=U3_U_adc-optical_SD4_AC7 U4=U4_AC74; ports LED_IN=NetR8_AC74_1 OUT=NetR9_U_adc-optical_SD4_AC7_2
U_adc-optical/SD4/AC8: designators C17=C17_AC84 C18=C18_U_adc-optical_SD4_AC8 C19=C19_U_adc-optical_SD4_AC8 C20=C20_AC84 C21=C21_AC84 D1=D1_AC84 D2=D2_AC84 R8=R8_AC84 R9=R9_U_adc-optical_SD4_AC8 R10=R10_AC84 R11=R11_U_adc-optical_SD4_AC8 U3=U3_U_adc-optical_SD4_AC8 U4=U4_AC84; ports LED_IN=NetR8_AC84_1 OUT=NetR9_U_adc-optical_SD4_AC8_2
U_adc-optical/SD5_Special/AC1: designators C17=C17_AC15 C18=C18_U_adc-optical_SD5_Special_AC1 C19=C19_U_adc-optical_SD5_Special_AC1 C20=C20_AC15 C21=C21_AC15 D1=D1_AC15 D2=D2_AC15 R8=R8_AC15 R9=R9_U_adc-optical_SD5_Special_AC1 R10=R10_AC15 R11=R11_U_adc-optical_SD5_Special_AC1 U3=U3_U_adc-optical_SD5_Special_AC1 U4=U4_AC15; ports LED_IN=NetR8_AC15_1 OUT=NetR9_U_adc-optical_SD5_Special_AC1_2
U_adc-optical/SD5_Special/AC2: designators C17=C17_AC25 C18=C18_U_adc-optical_SD5_Special_AC2 C19=C19_U_adc-optical_SD5_Special_AC2 C20=C20_AC25 C21=C21_AC25 D1=D1_AC25 D2=D2_AC25 R8=R8_AC25 R9=R9_U_adc-optical_SD5_Special_AC2 R10=R10_AC25 R11=R11_U_adc-optical_SD5_Special_AC2 U3=U3_U_adc-optical_SD5_Special_AC2 U4=U4_AC25; ports LED_IN=NetR8_AC25_1 OUT=NetR9_U_adc-optical_SD5_Special_AC2_2

### Notes on the sheet
- (near D1) 3mA - 20mA
- Outputs 240 uV/pA
- (near R11) Outputs 2.4 uV / pA

### Library data of the parts
C17-C21 = Cap Semi: Capacitor (Semiconductor SIM Model); Published: 8-Jun-2000; LatestRevisionDate: 29-May-2009; LatestRevisionNote: IPC-7351 Footprint Added.; PackageReference: C1206; Publisher: Altium Limited; PackageDescription: Chip Capacitor
  C17: Value: 1pF
  C18 C20: Value: 0.1uF
  C19 C21: Value: 1uF
D1 = LED2: as D3 on sheet pay-optical; Published: 8-Jun-2000; LatestRevisionDate: 17-Jul-2002; LatestRevisionNote: Re-released for DXP Platform.; PackageVersion: Feb-2002; PackageReference: 3.2X1.6X1.1; Publisher: Altium Limited; PackageDescription: SM LED; 2 Flat Leads; Supplier: Digi-Key
D2 = Photo Sen: Photosensitive Diode; Published: 24-Mar-1999; LatestRevisionDate: 17-Jul-2002; LatestRevisionNote: Re-released for DXP Platform.; PackageReference: PIN2; Publisher: Altium Limited; Supplier: Digi-Key
R8-R11 = Res3: Resistor; Published: 8-Jun-2000; LatestRevisionDate: 29-May-2009; LatestRevisionNote: IPC-7351 Footprint Added.; PackageReference: J1-0603; Publisher: Altium Limited; PackageDescription: Chip Resistor
  R8: Value: 330
  R9: Value: 10K
  R10: Value: 1M
  R11: Value: 100
U3 U4 = AD8605: Low noise, precision rail-to-rail op-amp.; Supplier 1: Digi-Key

## Sheet mux-optical.SchDoc: MUX-OPTICAL
size A4; DrawnBy: Dylan Vogel; Organization: UTAT SS; DocumentNumber: 6; Revision: 1; SheetNumber: 6; SheetTotal: 7
Used 10 times, as channels U_adc-optical/SD1/MUX_LED, U_adc-optical/SD1/MUX_S, U_adc-optical/SD2/MUX_LED, U_adc-optical/SD2/MUX_S, U_adc-optical/SD3/MUX_LED, U_adc-optical/SD3/MUX_S, U_adc-optical/SD4/MUX_LED, U_adc-optical/SD4/MUX_S, U_adc-optical/SD5_Special/MUX_LED, U_adc-optical/SD5_Special/MUX_S. Parts and nets are listed once, with the designators drawn on the sheet.
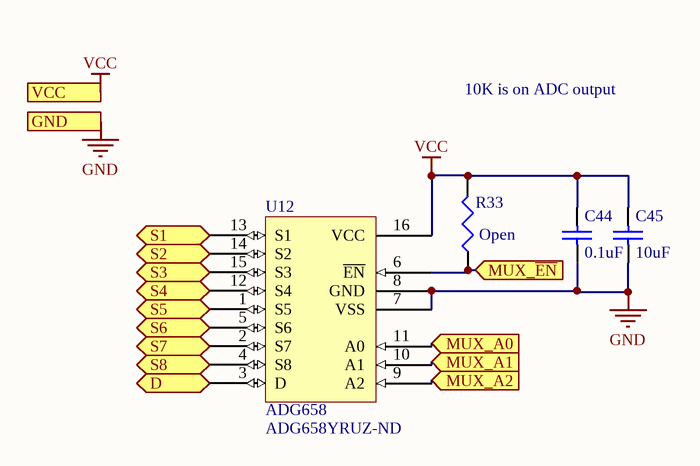
[diagram p4: mux-optical.SchDoc]

### Parts
C44  0.1uF  [1608[0603]]
C45  10uF  [1608[0603]]
R33  Open  [J1-0603]
U12  ADG658  Supplier Part Number 1: ADG658YRUZ-ND  [SSOP16_N]

### Ports
D (bidir), GND, MUX_A0 (in), MUX_A1 (in), MUX_A2 (in), MUX_~{EN} (in), S1 (bidir), S2 (bidir), S3 (bidir), S4 (bidir), S5 (bidir), S6 (bidir), S7 (bidir), S8 (bidir), VCC

### Nets
GND: C44.1 C45.1 U12.7(VSS) U12.8(GND) ; port GND
VCC: C44.2 C45.2 R33.2 U12.16(VCC) ; port VCC
D: U12.3(D) ; port D
MUX_A0: U12.11(A0) ; port MUX_A0
MUX_A1: U12.10(A1) ; port MUX_A1
MUX_A2: U12.9(A2) ; port MUX_A2
MUX_~{EN}: R33.1 U12.6(~{EN}) ; port MUX_~{EN}
S1: U12.13(S1) ; port S1
S2: U12.14(S2) ; port S2
S3: U12.15(S3) ; port S3
S4: U12.12(S4) ; port S4
S5: U12.1(S5) ; port S5
S6: U12.5(S6) ; port S6
S7: U12.2(S7) ; port S7
S8: U12.4(S8) ; port S8

### Channels
U_adc-optical/SD1/MUX_LED: designators C44=C44_MUX_LED1 C45=C45_MUX_LED1 R33=R27_MUX_LED1 U12=U12_MUX_LED1; ports D=NetU9_SD1_1 GND=GND MUX_A0=A0 MUX_A1=A1 MUX_A2=A2 MUX_~{EN}=~{EN} S1=NetR8_AC11_1 S2=NetR8_AC21_1 S3=NetR8_AC31_1 S4=NetR8_AC41_1 S5=NetR8_AC51_1 S6=NetR8_AC61_1 S7=NetR8_AC71_1 S8=NetR8_AC81_1 VCC=3V
U_adc-optical/SD1/MUX_S: designators C44=C44_MUX_S1 C45=C45_MUX_S1 R33=R27_MUX_S1 U12=U12_MUX_S1; ports D=NetC27_SD1_2 GND=GND MUX_A0=A0 MUX_A1=A1 MUX_A2=A2 MUX_~{EN}=~{EN} S1=NetR9_U_adc-optical_SD1_AC1_2 S2=NetR9_U_adc-optical_SD1_AC2_2 S3=NetR9_U_adc-optical_SD1_AC3_2 S4=NetR9_U_adc-optical_SD1_AC4_2 S5=NetR9_U_adc-optical_SD1_AC5_2 S6=NetR9_U_adc-optical_SD1_AC6_2 S7=NetR9_U_adc-optical_SD1_AC7_2 S8=NetR9_U_adc-optical_SD1_AC8_2 VCC=3V
U_adc-optical/SD2/MUX_LED: designators C44=C44_MUX_LED2 C45=C45_MUX_LED2 R33=R27_MUX_LED2 U12=U12_MUX_LED2; ports D=NetU9_SD2_1 GND=GND MUX_A0=A0 MUX_A1=A1 MUX_A2=A2 MUX_~{EN}=~{EN} S1=NetR8_AC12_1 S2=NetR8_AC22_1 S3=NetR8_AC32_1 S4=NetR8_AC42_1 S5=NetR8_AC52_1 S6=NetR8_AC62_1 S7=NetR8_AC72_1 S8=NetR8_AC82_1 VCC=3V
U_adc-optical/SD2/MUX_S: designators C44=C44_MUX_S2 C45=C45_MUX_S2 R33=R27_MUX_S2 U12=U12_MUX_S2; ports D=NetC27_SD2_2 GND=GND MUX_A0=A0 MUX_A1=A1 MUX_A2=A2 MUX_~{EN}=~{EN} S1=NetR9_U_adc-optical_SD2_AC1_2 S2=NetR9_U_adc-optical_SD2_AC2_2 S3=NetR9_U_adc-optical_SD2_AC3_2 S4=NetR9_U_adc-optical_SD2_AC4_2 S5=NetR9_U_adc-optical_SD2_AC5_2 S6=NetR9_U_adc-optical_SD2_AC6_2 S7=NetR9_U_adc-optical_SD2_AC7_2 S8=NetR9_U_adc-optical_SD2_AC8_2 VCC=3V
U_adc-optical/SD3/MUX_LED: designators C44=C44_MUX_LED3 C45=C45_MUX_LED3 R33=R27_MUX_LED3 U12=U12_MUX_LED3; ports D=NetU9_SD3_1 GND=GND MUX_A0=A0 MUX_A1=A1 MUX_A2=A2 MUX_~{EN}=~{EN} S1=NetR8_AC13_1 S2=NetR8_AC23_1 S3=NetR8_AC33_1 S4=NetR8_AC43_1 S5=NetR8_AC53_1 S6=NetR8_AC63_1 S7=NetR8_AC73_1 S8=NetR8_AC83_1 VCC=3V
U_adc-optical/SD3/MUX_S: designators C44=C44_MUX_S3 C45=C45_MUX_S3 R33=R27_MUX_S3 U12=U12_MUX_S3; ports D=NetC27_SD3_2 GND=GND MUX_A0=A0 MUX_A1=A1 MUX_A2=A2 MUX_~{EN}=~{EN} S1=NetR9_U_adc-optical_SD3_AC1_2 S2=NetR9_U_adc-optical_SD3_AC2_2 S3=NetR9_U_adc-optical_SD3_AC3_2 S4=NetR9_U_adc-optical_SD3_AC4_2 S5=NetR9_U_adc-optical_SD3_AC5_2 S6=NetR9_U_adc-optical_SD3_AC6_2 S7=NetR9_U_adc-optical_SD3_AC7_2 S8=NetR9_U_adc-optical_SD3_AC8_2 VCC=3V
U_adc-optical/SD4/MUX_LED: designators C44=C44_MUX_LED4 C45=C45_MUX_LED4 R33=R27_MUX_LED4 U12=U12_MUX_LED4; ports D=NetU9_SD4_1 GND=GND MUX_A0=A0 MUX_A1=A1 MUX_A2=A2 MUX_~{EN}=MUX_~{EN} S1=NetR8_AC14_1 S2=NetR8_AC24_1 S3=NetR8_AC34_1 S4=NetR8_AC44_1 S5=NetR8_AC54_1 S6=NetR8_AC64_1 S7=NetR8_AC74_1 S8=NetR8_AC84_1 VCC=3V
U_adc-optical/SD4/MUX_S: designators C44=C44_MUX_S4 C45=C45_MUX_S4 R33=R27_MUX_S4 U12=U12_MUX_S4; ports D=NetC27_SD4_2 GND=GND MUX_A0=A0 MUX_A1=A1 MUX_A2=A2 MUX_~{EN}=MUX_~{EN} S1=NetR9_U_adc-optical_SD4_AC1_2 S2=NetR9_U_adc-optical_SD4_AC2_2 S3=NetR9_U_adc-optical_SD4_AC3_2 S4=NetR9_U_adc-optical_SD4_AC4_2 S5=NetR9_U_adc-optical_SD4_AC5_2 S6=NetR9_U_adc-optical_SD4_AC6_2 S7=NetR9_U_adc-optical_SD4_AC7_2 S8=NetR9_U_adc-optical_SD4_AC8_2 VCC=3V
U_adc-optical/SD5_Special/MUX_LED: designators C44=C44_MUX_LED5 C45=C45_MUX_LED5 R33=R27_MUX_LED5 U12=U12_MUX_LED5; ports D=NetU9_SD4_1 GND=GND MUX_A0=A0 MUX_A1=A1 MUX_A2=A2 MUX_~{EN}=MUX_5_EN S1=NetR8_AC15_1 S2=NetR8_AC25_1 S3=NetU12_MUX_LED5_15 S4=NetU12_MUX_LED5_12 S5=NetU12_MUX_LED5_1 S6=NetU12_MUX_LED5_5 S7=NetU12_MUX_LED5_2 S8=NetU12_MUX_LED5_4 VCC=3V
U_adc-optical/SD5_Special/MUX_S: designators C44=C44_MUX_S5 C45=C45_MUX_S5 R33=R27_MUX_S5 U12=U12_MUX_S5; ports D=NetC27_SD4_2 GND=GND MUX_A0=A0 MUX_A1=A1 MUX_A2=A2 MUX_~{EN}=MUX_5_EN S1=NetR9_U_adc-optical_SD5_Special_AC1_2 S2=NetR9_U_adc-optical_SD5_Special_AC2_2 S3=NetU3_1 S4=NetC18_1 S5=NetU12_MUX_S5_1 S6=NetU12_MUX_S5_5 S7=NetU12_MUX_S5_2 S8=NetU12_MUX_S5_4 VCC=3V

### Notes on the sheet
- 10K is on ADC output

### Library data of the parts
C44 C45 = Cap Semi: Capacitor (Semiconductor SIM Model); Published: 8-Jun-2000; LatestRevisionDate: 29-May-2009; LatestRevisionNote: IPC-7351 Footprint Added.; PackageReference: C1206; Publisher: Altium Limited; PackageDescription: Chip Capacitor
  C44: Value: 0.1uF
  C45: Value: 10uF
R33 = Res3: Resistor; Published: 8-Jun-2000; LatestRevisionDate: 29-May-2009; LatestRevisionNote: IPC-7351 Footprint Added.; PackageReference: J1-0603; Publisher: Altium Limited; PackageDescription: Chip Resistor; Value: Open
U12 = ADG658: Eight channel analog multiplexer.; Supplier 1: Digi-Key

## Sheet filtering-optical-special.SchDoc
size A4
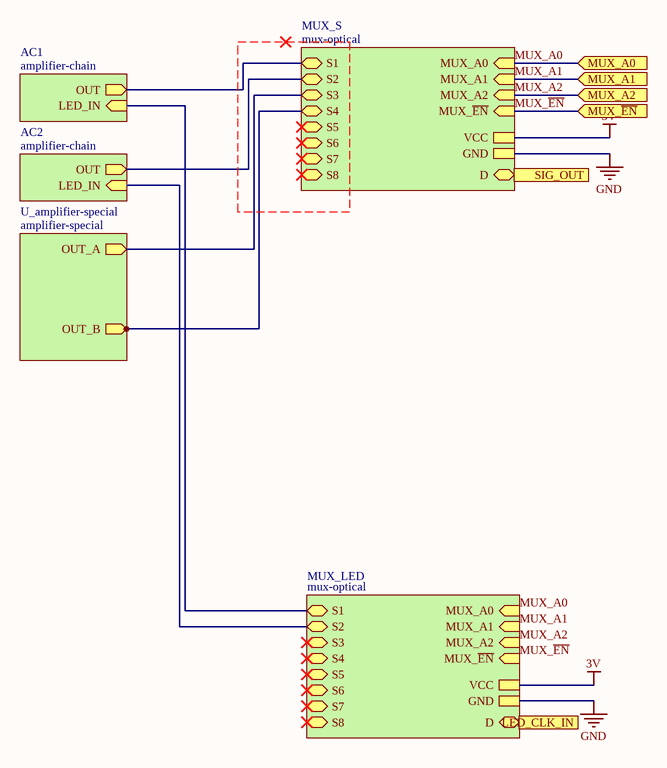
[diagram p5: filtering-optical-special.SchDoc]

### Sub-sheets
AC1 = amplifier-chain: OUT (out), LED_IN (in)
AC2 = amplifier-chain: OUT (out), LED_IN (in)
MUX_LED = mux-optical: MUX_A0 (in), MUX_A1 (in), MUX_A2 (in), MUX_~{EN} (in), VCC, GND, S1 (bidir), S2 (bidir), S3 (bidir), S4 (bidir), S5 (bidir), S6 (bidir), S7 (bidir), S8 (bidir), D (bidir)
MUX_S = mux-optical: MUX_A0 (in), MUX_A1 (in), MUX_A2 (in), MUX_~{EN} (in), VCC, GND, S1 (bidir), S2 (bidir), S3 (bidir), S4 (bidir), S5 (bidir), S6 (bidir), S7 (bidir), S8 (bidir), D (bidir)
U_amplifier-special = amplifier-special: OUT_B (out), OUT_A (out)

### Ports
LED_CLK_IN (in), MUX_A0 (in), MUX_A1 (in), MUX_A2 (in), MUX_~{EN} (in), SIG_OUT (out)

### Nets
3V: sheet MUX_LED/VCC, sheet MUX_S/VCC
GND: sheet MUX_LED/GND, sheet MUX_S/GND
MUX_A0: port MUX_A0, sheet MUX_LED/MUX_A0, sheet MUX_S/MUX_A0  [project net A0]
MUX_A1: port MUX_A1, sheet MUX_LED/MUX_A1, sheet MUX_S/MUX_A1  [project net A1]
MUX_A2: port MUX_A2, sheet MUX_LED/MUX_A2, sheet MUX_S/MUX_A2  [project net A2]
MUX_~{EN}: port MUX_~{EN}, sheet MUX_LED/MUX_~{EN}, sheet MUX_S/MUX_~{EN}  [project net MUX_5_EN]
NetC18_1: sheet MUX_S/S4, sheet U_amplifier-special/OUT_B
NetC27_SD4_2: port SIG_OUT, sheet MUX_S/D
NetR8_AC15_1: sheet AC1/LED_IN, sheet MUX_LED/S1
NetR8_AC25_1: sheet AC2/LED_IN, sheet MUX_LED/S2
NetR9_U_adc-optical_SD5_Special_AC1_2: sheet AC1/OUT, sheet MUX_S/S1
NetR9_U_adc-optical_SD5_Special_AC2_2: sheet AC2/OUT, sheet MUX_S/S2
NetU3_1: sheet MUX_S/S3, sheet U_amplifier-special/OUT_A
NetU9_SD4_1: port LED_CLK_IN, sheet MUX_LED/D

## Sheet amplifier-special.SchDoc
size A4
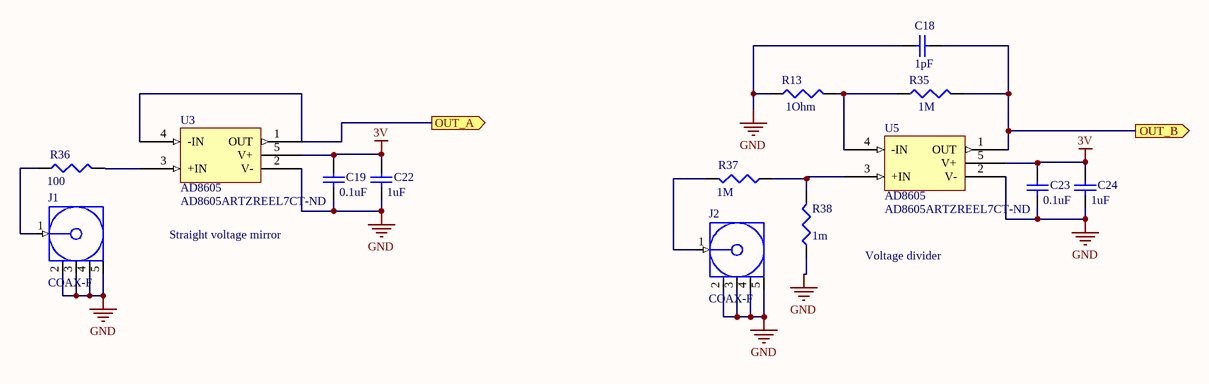
[diagram p6: amplifier-special.SchDoc]

### Parts
C18  value 1pF  [0402]  (hidden comment: 0.1uF)
C19  0.1uF  [0402]
C22  1uF  [1608[0603]]
C23  0.1uF  [0402]
C24  1uF  [1608[0603]]
J1  COAX-F  [MCX5.08-H5]
J2  COAX-F  [MCX5.08-H5]
R13  value 1Ohm  [J1-0603]  (hidden comment: 1 Ohm)
R35  1M  [0402]
R36  100  [0402]
R37  1M  [0402]
R38  1m  [14-1210]
U3  AD8605  Supplier Part Number 1: AD8605ARTZREEL7CT-ND  [SOP-65P200X125-5N]
U5  AD8605  Supplier Part Number 1: AD8605ARTZREEL7CT-ND  [SOP-65P200X125-5N]

### Ports
OUT_A (out), OUT_B (out)

### Nets
3V: C19.2 C22.2 C23.2 C24.2 U3.5(V+) U5.5(V+)
GND: C18.2 C19.1 C22.1 C23.1 C24.1 J1.2(GND) J1.3(GND) J1.4(GND) J1.5(GND) J2.2(GND) J2.3(GND) J2.4(GND) J2.5(GND) R13.1 R38.1 U3.2(V-) U5.2(V-)
NetC18_1: C18.1 R35.2 U5.1(OUT) ; port OUT_B
NetJ1_1: J1.1(Signal) R36.1
NetJ2_1: J2.1(Signal) R37.2
NetR13_2: R13.2 R35.1 U5.4(-IN)
NetR36_2: R36.2 U3.3(+IN)
NetR37_1: R37.1 R38.2 U5.3(+IN)
NetU3_1: U3.1(OUT) U3.4(-IN) ; port OUT_A

### Notes on the sheet
- Straight voltage mirror
- Voltage divider

### Library data of the parts
C18 C19 C22-C24 = Cap Semi: Capacitor (Semiconductor SIM Model); Published: 8-Jun-2000; LatestRevisionDate: 29-May-2009; LatestRevisionNote: IPC-7351 Footprint Added.; PackageReference: C1206; Publisher: Altium Limited; PackageDescription: Chip Capacitor; Supplier: Digi-Key
  C19 C23: Value: 0.1uF
  C22 C24: Value: 1uF
J1 J2 = COAX-F: RF Coaxial PCB Connector, MCX; Thru-Hole, Right-Angle Mount Socket, Blunt Post Terminal, 50 Ohm Impedance; PCB_Layout: Complies with manufacturer's recommendation.; DrillSize: Corresponds to nominal value.; Published: 15-Jul-2004; LatestRevisionDate: 15-Jul-2004; LatestRevisionNote: Component Replaced.; DatasheetDocument: 30-May-2003; PackageDocument: 04-Jul-1999; PackageReference: 919-119J-51AX; Publisher: Altium Limited; ComponentLink1Description: Manufacturer Link; ComponentLink1URL: http://www.amphenolrf.com/
R13 R35-R38 = Res3: Resistor; Published: 8-Jun-2000; LatestRevisionDate: 29-May-2009; LatestRevisionNote: IPC-7351 Footprint Added.; PackageReference: J1-0603; Publisher: Altium Limited; PackageDescription: Chip Resistor
  R35 R37: Value: 1M
  R36: Value: 100
  R38: Value: 1m
U3 U5 = AD8605: as U3 on sheet amplifier-chain; Supplier 1: Digi-Key; Supplier: Digi-Key

## Sheet dac-layout.SchDoc: DAC
size A4; DrawnBy: Dylan Vogel; Organization: UTAT SS; DocumentNumber: 10; Revision: 1; SheetNumber: 10; SheetTotal: 11
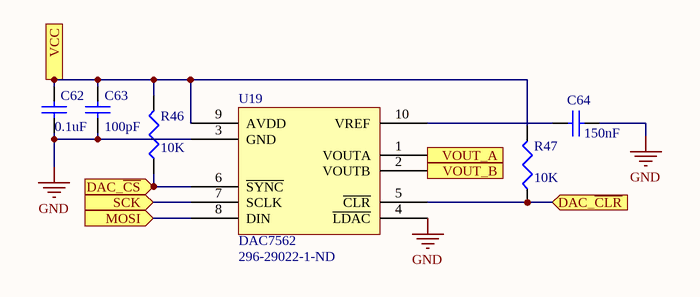
[diagram p7: dac-layout.SchDoc]

### Parts
C62  0.1uF  [0402]
C63  100pF  [0402]
C64  150nF  [0402]
R46  10K  [0402]
R47  10K  [0402]
U19  DAC7562  Supplier Part Number 1: 296-29022-1-ND  [SOP10-50P300X300-10N]

### Ports
DAC_~{CLR} (in), DAC_~{CS} (in), MOSI (in), SCK (in), VCC (in), VOUT_A (out), VOUT_B (out)

### Nets
3V: C62.2 C63.2 R46.2 R47.2 U19.9(AVDD) ; port VCC
GND: C62.1 C63.1 C64.2 U19.3(GND) U19.4(~{LDAC})
DAC_~{CS}: R46.1 U19.6(~{SYNC}) ; port DAC_~{CS}
MOSI: U19.8(DIN) ; port MOSI
SCK: U19.7(SCLK) ; port SCK
NetC64_1: C64.1 U19.10(VREF)
NetR47_1: R47.1 U19.5(~{CLR}) ; port DAC_~{CLR}
NetU1_19: U19.1(VOUTA) ; port VOUT_A
NetU1_20: U19.2(VOUTB) ; port VOUT_B

### Library data of the parts
C62-C64 = Cap Semi: Capacitor (Semiconductor SIM Model); Published: 8-Jun-2000; LatestRevisionDate: 29-May-2009; LatestRevisionNote: IPC-7351 Footprint Added.; PackageReference: C1206; Publisher: Altium Limited; PackageDescription: Chip Capacitor; Supplier: Digi-Key
  C62: Value: 0.1uF; Supplier Part Number: 587-3807-1-ND
  C63: Value: 100pF; Supplier Part Number: 1276-1632-1-ND
  C64: Value: 150nF; Supplier Part Number: 1276-1972-1-ND
R46 R47 = Res3: Resistor; Published: 8-Jun-2000; LatestRevisionDate: 29-May-2009; LatestRevisionNote: IPC-7351 Footprint Added.; PackageReference: J1-0603; Publisher: Altium Limited; PackageDescription: Chip Resistor; Value: 10K; Supplier: Digi-Key
U19 = DAC7562: 12-bit, low-power, voltage-output DAC with internal reference.; Supplier 1: Digi-Key; Supplier: Digi-Key